# EAGLE design ATMEGA8535 (EAGLE 7.2.0)
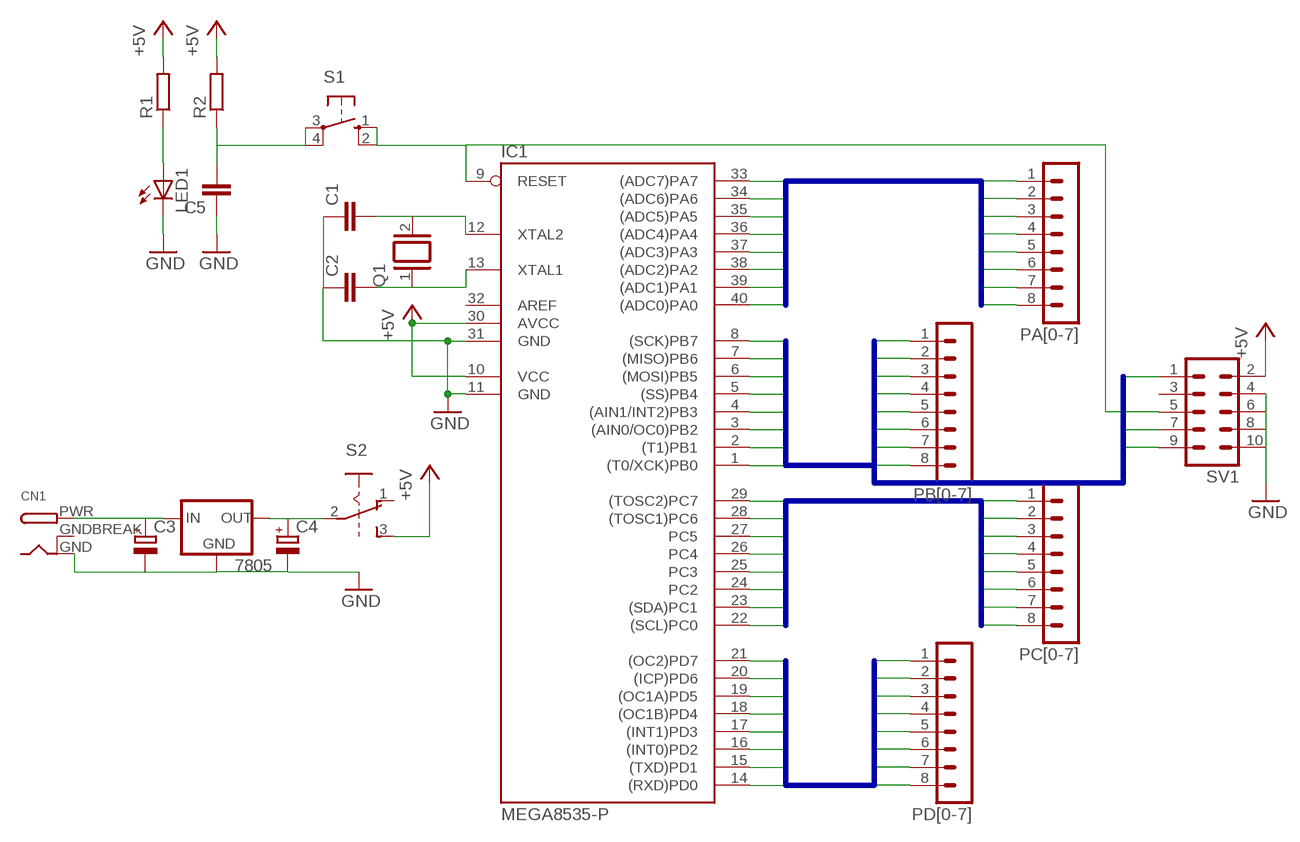
[diagram p0: schematic, sheet 1]

## Parts
7805  78XXL  [78XXL]
C1  C-EU025-025X050  [C025-025X050]
C2  C-EU025-025X050  [C025-025X050]
C3  CPOL-EUE2.5-5  [E2,5-5]
C4  CPOL-EUE2.5-5  [E2,5-5]
C5  C-EU050-025X075  [C050-025X075]
CN1  DCBARRELPTH  [DCJACK_2MM_PTH]
IC1  MEGA8535-P  [DIL40]
LED1  LED5MM  [LED5MM]
PA[0-7]  MA08-1  [MA08-1]
PB[0-7]  MA08-1  [MA08-1]
PC[0-7]  MA08-1  [MA08-1]
PD[0-7]  MA08-1  [MA08-1]
Q1  XTAL/S  [QS]
R1  R-EU_0207/7  [0207/7]
R2  R-EU_0207/7  [0207/7]
S1  10-XX  [B3F-10XX]
S2  A68-A31  [A68-A31]
SV1  MA05-2  [MA05-2]

## Nets
+5V: IC1.10(VCC) IC1.30(AVCC) R1.2 R2.2 S2.3(A:S) SV1.2
GND: 7805.GND C1.1 C2.1 C3.- C4.- C5.1 CN1.GND IC1.11(GND) IC1.31(GND) LED1.K(C) SV1.4 SV1.6 SV1.8 SV1.10
N$3: IC1.9(RESET) S1.1(S) S1.2(S1) SV1.5
N$4: C2.2 IC1.13(XTAL1) Q1.1
N$5: C1.2 IC1.12(XTAL2) Q1.2
N$6: 7805.IN C3.+ CN1.PWR
N$7: LED1.A R1.1
N$8: 7805.OUT C4.+ S2.2(A:P)
N$11: C5.2 R2.1 S1.3(P) S1.4(P1)
PA0: IC1.40((ADC0)PA0) PA[0-7].1
PA1: IC1.39((ADC1)PA1) PA[0-7].2
PA2: IC1.38((ADC2)PA2) PA[0-7].3
PA3: IC1.37((ADC3)PA3) PA[0-7].4
PA4: IC1.36((ADC4)PA4) PA[0-7].5
PA5: IC1.35((ADC5)PA5) PA[0-7].6
PA6: IC1.34((ADC6)PA6) PA[0-7].7
PA7: IC1.33((ADC7)PA7) PA[0-7].8
PB0: IC1.1((T0/XCK)PB0) PB[0-7].1
PB1: IC1.2((T1)PB1) PB[0-7].2
PB2: IC1.3((AIN0/OC0)PB2) PB[0-7].3
PB3: IC1.4((AIN1/INT2)PB3) PB[0-7].4
PB4: IC1.5((SS)PB4) PB[0-7].5
PB5: IC1.6((MOSI)PB5) PB[0-7].6 SV1.1
PB6: IC1.7((MISO)PB6) PB[0-7].7 SV1.9
PB7: IC1.8((SCK)PB7) PB[0-7].8 SV1.7
PC0: IC1.22((SCL)PC0) PC[0-7].1
PC1: IC1.23((SDA)PC1) PC[0-7].2
PC2: IC1.24(PC2) PC[0-7].3
PC3: IC1.25(PC3) PC[0-7].4
PC4: IC1.26(PC4) PC[0-7].5
PC5: IC1.27(PC5) PC[0-7].6
PC6: IC1.28((TOSC1)PC6) PC[0-7].7
PC7: IC1.29((TOSC2)PC7) PC[0-7].8
PD0: IC1.14((RXD)PD0) PD[0-7].1
PD1: IC1.15((TXD)PD1) PD[0-7].2
PD2: IC1.16((INT0)PD2) PD[0-7].3
PD3: IC1.17((INT1)PD3) PD[0-7].4
PD4: IC1.18((OC1B)PD4) PD[0-7].5
PD5: IC1.19((OC1A)PD5) PD[0-7].6
PD6: IC1.20((ICP)PD6) PD[0-7].7
PD7: IC1.21((OC2)PD7) PD[0-7].8
Unconnected: IC1.32(AREF) S2.1(A:O) S2.4(B:O) S2.5(B:P) S2.6(B:S) SV1.3

## Buses
PA[0..7]
PB[0..7]
PC[0..7]
PD[0..7]

## Power pins joined to a net without a drawn wire
GNDBREAK: CN1.GNDBREAK

## Library data of the parts
7805 = v-reg:78XXL: VOLTAGE REGULATOR
C1 C2 C5 = resistor:C-EU: CAPACITOR, European symbol
C3 C4 = resistor:CPOL-EU: POLARIZED CAPACITOR, European symbol
CN1 = adafruit:DCBARREL: 2.0mm DC Barrel Jack DCJACK_2MM_PTH - Through Hole Jack (4UConnector: 05537)
IC1 = atmel:MEGA8535-P: MICROCONTROLLER 8 Kbytes FLASH 512 bytes SRAM 512 bytes EEPROM USART 8-channel 10 bit ADC Source: avr.lbr; MPN: ATMEGA8535-16PU; OC_FARNELL: 9171444; OC_NEWARK: 01M6909
LED1 = adafruit:LED: LED OSRAM: - CHIPLED LG R971, LG N971, LY N971, LG Q971, LY Q971, LO R971, LY R971 LH N974, LH R974 LS Q976, LO Q976, LY Q976 LO Q996 - Hyper CHIPLED LW Q18S LB Q993, LB Q99A, LB R99A - SideLED LS A670, LO A670, LY A670, LG A670, LP A670 LB A673, LV A673, LT A673, LW A673 LH A674 LY A675 LS A676, LA A676, LO A676, LY A676, LW A676 LS A679, LY A679, LG A679 - Hyper Micro SIDELED® LS Y876, LA Y876, LO Y876, LY Y876 LT Y87S - SmartLED LW L88C, LW L88S LB L89C, LB L89S, LG L890 LS L89K, LO L89K, LY L89K LS L896, LA L896, LO L896, LY L896 - TOPLED LS T670, LO T670, LY T670, LG T670, LP T670 LSG T670, LSP T670, LSY T670, LOP T670, LYG T670 LG T671, LOG T671, LSG T671 LB T673, LV T673, LT T673, LW T673 LH T674 LS T676, LA T676, LO T676, LY T676, LB T676, LH T676, LSB T676, LW T676 LB T67C, LV T67C, LT T67C, LS T67K, LO T67K, LY T67K, LW E67C LS E67B, LA E67B, LO E67B, LY E67B, LB E67C, LV E67C, LT E67C LW T67C LS T679, LY T679, LG T679 LS T770, LO T770, LY T770, LG T770, LP T770 LB T773, LV T773, LT T773, LW T773 LH T774 LS E675, LA E675, LY E675, LS T675 LS T776, LA T776, LO T776, LY T776, LB T776 LHGB T686 LT T68C, LB T68C - Hyper Mini TOPLED® LB M676 - Mini TOPLED Santana® LG M470 LS M47K, LO M47K, LY M47K Source: http://www.osram.convergy.de/
PA[0-7] PB[0-7] PC[0-7] PD[0-7] = con-lstb:MA08-1: PIN HEADER; OC_FARNELL: unknown; OC_NEWARK: unknown
Q1 = special:XTAL/S: CRYSTAL
R1 R2 = resistor:R-EU_: RESISTOR, European symbol
S1 = switch-omron:10-XX: OMRON SWITCH; MPN: B3F-1000; OC_FARNELL: 176432; OC_NEWARK: 36M3542
S2 = switch:A68-A31: SLIDING SWITCH Siemens, distributor Buerklin, 11G766
SV1 = con-lstb:MA05-2: PIN HEADER; OC_FARNELL: unknown; OC_NEWARK: unknown

## Net classes
0 default: width 0.508 mm, clearance 0.254 mm
1 vcc: width 0.508 mm, clearance 0.254 mm
2 gnd: width 0.508 mm, clearance 0.254 mm

## Board
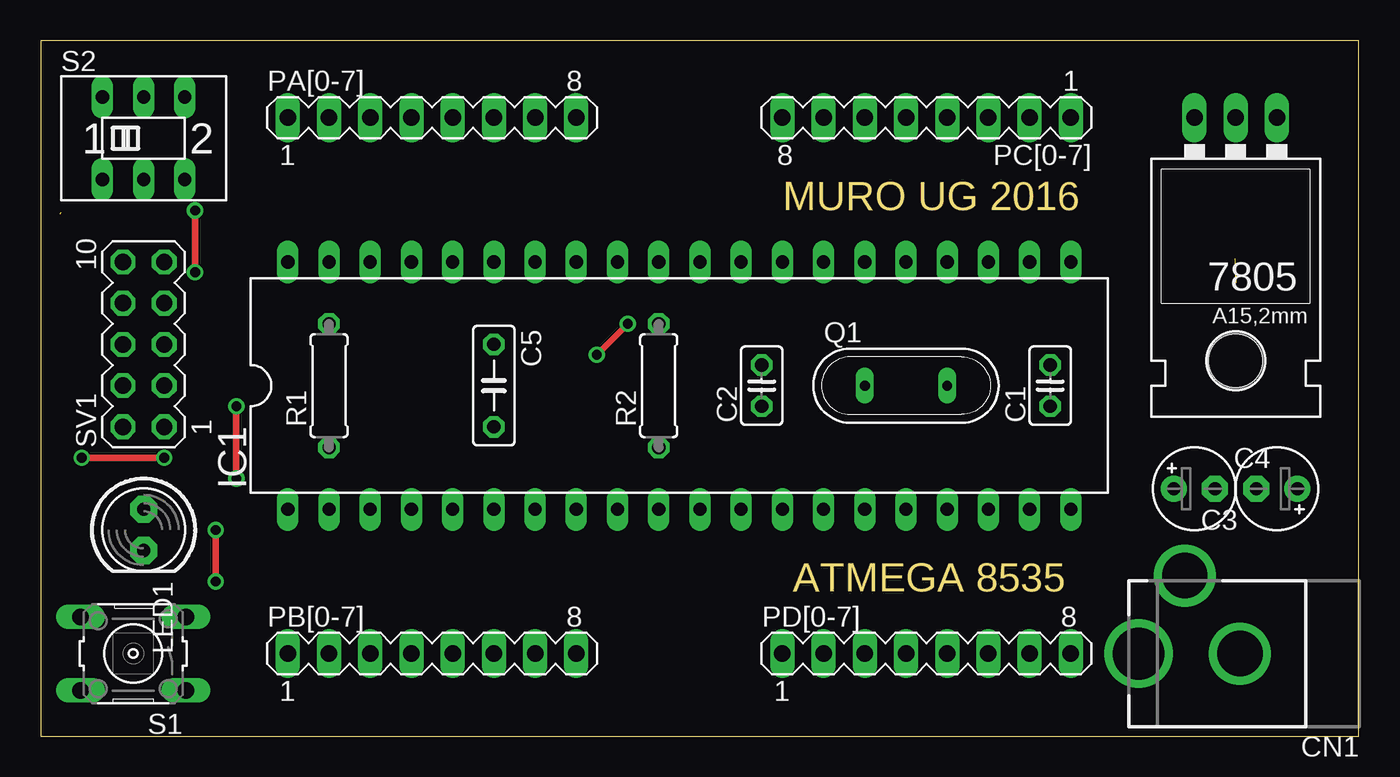
[diagram p1: board, top side]
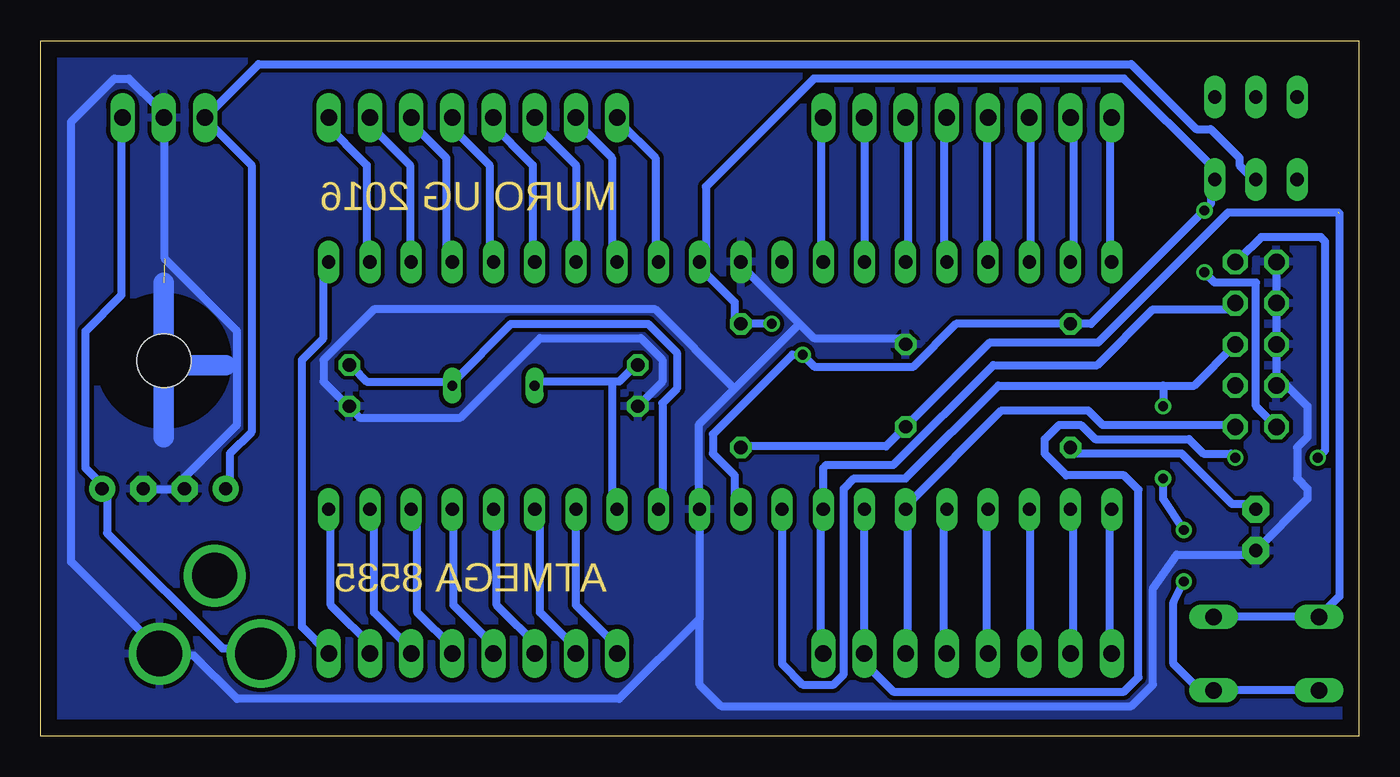
[diagram p2: board, bottom side, seen from below]

Size 81.26 x 42.85 mm. Coordinates in mm from the lower left corner, seen from the top.
Outline: 0,0 81.26,0 81.26,42.85 0,42.85 0,0
Copper layers (1*16): Top 0.035mm / dielectric 1.5mm / Bottom 0.035mm
Design rules "default": minimum track width 10mil, minimum drill 24mil, track to track 8mil, track to pad 8mil, pad to pad 8mil, via to via 8mil, smd to smd 8mil, copper to edge 40mil, drill to drill 8mil, minimum pad ring 10mil, minimum via ring 8mil, stop-mask expansion 4mil, vias tented up to drill 0mil, thermal gap 10mil

### Footprints (pad centres in the part's own frame; a part is rotated, then mirrored left to right if it is on the bottom)
78XXL = drill 1.016 long: GND 0,-3.81; IN -2.54,-3.81; OUT 2.54,-3.81 | hole 3.302: 0,11.176
C025-025X050 = drill 0.813 octagon: 1 -1.27,0; 2 1.27,0
E2,5-5 = drill 0.813 pad 1.6: + -1.27,0 | drill 0.813 pad 1.6 octagon: - 1.27,0
C050-025X075 = drill 0.813 octagon: 1 -2.54,0; 2 2.54,0
DCJACK_2MM_PTH = drill 2.8: GND 0,7.35; GNDBREAK 4.8,10.75 | drill 3.2: PWR 0,13.6
DIL40 = drill 0.813 long: 1 -24.13,-7.62; 2 -21.59,-7.62; 3 -19.05,-7.62; 4 -16.51,-7.62; 5 -13.97,-7.62; 6 -11.43,-7.62; 7 -8.89,-7.62; 8 -6.35,-7.62; 9 -3.81,-7.62; 10 -1.27,-7.62; 11 1.27,-7.62; 12 3.81,-7.62; 13 6.35,-7.62; 14 8.89,-7.62; 15 11.43,-7.62; 16 13.97,-7.62; 17 16.51,-7.62; 18 19.05,-7.62; 19 21.59,-7.62; 20 24.13,-7.62; 21 24.13,7.62; 22 21.59,7.62; 23 19.05,7.62; 24 16.51,7.62; 25 13.97,7.62; 26 11.43,7.62; 27 8.89,7.62; 28 6.35,7.62; 29 3.81,7.62; 30 1.27,7.62; 31 -1.27,7.62; 32 -3.81,7.62; 33 -6.35,7.62; 34 -8.89,7.62; 35 -11.43,7.62; 36 -13.97,7.62; 37 -16.51,7.62; 38 -19.05,7.62; 39 -21.59,7.62; 40 -24.13,7.62
LED5MM = drill 0.813 pad 1.676 octagon: A -1.27,0; K 1.27,0
MA08-1 = drill 1.016 long: 1 -8.89,0; 2 -6.35,0; 3 -3.81,0; 4 -1.27,0; 5 1.27,0; 6 3.81,0; 7 6.35,0; 8 8.89,0
QS = drill 0.61 long: 1 -2.54,0; 2 2.54,0
0207/7 = drill 0.813 octagon: 1 -3.81,0; 2 3.81,0
B3F-10XX = drill 1.016 long: 1 -3.251,2.261; 2 3.251,2.261; 3 -3.251,-2.261; 4 3.251,-2.261
A68-A31 = drill 0.813 long: 1 -2.54,-2.54; 2 0,-2.54; 3 2.54,-2.54; 4 -2.54,2.54; 5 0,2.54; 6 2.54,2.54
MA05-2 = drill 1.016 octagon: 1 -5.08,-1.27; 2 -5.08,1.27; 3 -2.54,-1.27; 4 -2.54,1.27; 5 0,-1.27; 6 0,1.27; 7 2.54,-1.27; 8 2.54,1.27; 9 5.08,-1.27; 10 5.08,1.27

### Placement (x,y rotation side)
7805  73.66,34.29 180 top
C1  62.23,21.59 90 top
C2  44.45,21.59 90 top
C3  76.2,15.24 180 top
C4  71.12,15.24 0 top
C5  27.94,21.59 270 top
CN1  81.28,5.08 90 top
IC1  39.37,21.59 0 top
LED1  6.35,12.7 270 top
PA[0-7]  24.13,38.1 0 top
PB[0-7]  24.13,5.08 0 top
PC[0-7]  54.61,38.1 180 top
PD[0-7]  54.61,5.08 0 top
Q1  53.34,21.59 0 top
R1  17.78,21.59 90 top
R2  38.1,21.59 90 top
S1  5.71,5.08 180 top
S2  6.35,36.83 0 top
SV1  6.35,24.13 90 top

### Tracks (layer width: path | path; a pad name or v marks a point on that pad's centre or on a via)
+5V  (via drill 0.6)
  Top 0.406: v9.52,28.57 v9.52,32.39 | v36.19,25.4 v34.29,23.5
  Bottom 0.508: IC1.10 38.48,14.29 38.48,16.07 39.81,17.4 39.81,18.61 34.92,23.5 v34.29,23.5 | 9.14,34.29 9.14,35.18 14.48,40.51 33.59,40.51 40.26,33.84 40.26,29.4 IC1.30 40.7,28.96 38.48,26.73 38.48,25.4 R2.2 v36.19,25.4 | 9.14,34.29 S2.3 | SV1.2 6.35,20.32 6.35,27.94 8.89,27.94 v9.52,28.57 | 9.14,34.29 9.14,32.77 v9.52,32.39 16.51,25.4 R1.2 24.83,25.4 27.5,22.73 33.53,22.73 v34.29,23.5 | v34.29,23.5 34.61,23.5
GND  (1 unrouted)
  Bottom 0.508: C3.- 74.93,15.18 72.71,15.18 C4.- 72.71,15.62 69.15,19.18 69.15,24.96 73.6,29.4 73.6,37.85 7805.GND 74.04,38.29 74.04,38.73 75.82,40.51 76.71,40.51 79.38,37.85 79.38,10.73 74.04,5.4 CN1.GND 73.6,4.95 71.82,4.95 69.15,2.29 45.59,2.29 40.64,7.24 | C2.1 42.93,21.84 42.93,23.18 44.26,24.51 50.48,24.51 55.37,19.62 61.59,19.62 62.04,20.07 C1.1 62.48,20.51 63.82,21.84 63.82,23.18 60.71,26.29 43.37,26.29 38.48,21.4 | 34.48,25.4 38.04,28.96 IC1.31 | 34.48,25.4 33.59,24.51 28.26,24.51 C5.1 | 34.48,25.4 38.48,21.4 | 38.48,21.4 40.7,19.18 40.7,14.29 IC1.11 40.64,7.24 | 40.64,7.24 40.64,3.17 39.31,1.84 14.03,1.84 12.7,3.17 12.7,9.08 11.24,11.18 6.48,11.18 LED1.K 3.17,14.61 3.17,15.24 3.81,15.87 3.81,17.78 3.17,18.41 3.17,20.32 4.45,21.59 SV1.4 SV1.6 SV1.8 SV1.10
  Bottom 1.27: 73.66,27.94 73.66,22.86 | 73.66,18.41 73.66,22.86 | 73.66,22.86 69.85,22.86
  pour Bottom: 0,43.18 0,0 81.28,0 81.28,43.18
N$3  (via drill 0.6)
  Top 0.406: v12.06,20.32 v12.06,15.87 | v10.8,12.7 v10.8,9.53
  Bottom 0.508: IC1.9 35.56,4.44 34.29,3.17 32.39,3.17 31.75,3.81 31.75,15.24 31.11,15.87 27.94,15.87 22.23,21.59 12.06,21.59 | 12.06,21.59 10.16,21.59 SV1.5 | 12.06,21.59 v12.06,20.32 | S1.2 S1.1 9.8,2.82 11.43,4.44 11.43,8.25 v10.8,9.53 | v10.8,12.7 12.06,14.61 v12.06,15.87
N$4
  Bottom 0.508: 46.04,21.84 45.59,21.84 44.7,22.73 C2.2 | 46.04,21.84 50.48,21.84 Q1.1 | 46.04,21.84 46.04,14.29 IC1.13
N$5
  Bottom 0.508: C1.2 62.04,22.73 61.15,21.84 56.26,21.84 Q1.2 55.82,21.84 52.26,25.4 43.81,25.4 42.04,23.62 42.04,21.4 42.93,20.51 42.93,14.29 IC1.12
N$6
  Bottom 0.508: 7805.IN 76.26,37.85 76.26,27.18 78.49,24.96 78.49,16.51 77.6,15.62 C3.+ 77.15,15.18 77.15,12.51 70.04,5.4 67.82,5.4 CN1.PWR
N$7
  Bottom 0.508: R1.1 17.59,17.4 10.92,17.4 7.81,14.29 6.48,14.29 LED1.A
N$8
  Bottom 0.508: S2.2 6.48,34.29 7.37,35.18 7.37,35.62 9.14,37.4 10.03,37.4 14.03,41.4 67.82,41.4 7805.OUT 70.93,37.85 68.26,35.18 68.26,18.73 69.6,17.4 69.6,15.62 C4.+
N$11  (1 unrouted)
  Bottom 0.508: R2.1 38.04,17.84 29.15,17.84 C5.2 22.73,24.26 16.07,24.26 8.06,32.26 1.27,32.26 | 1.21,32.19 1.21,8.6 S1.4 S1.3
PA0
  Bottom 0.508: IC1.40 15.37,29.4 15.37,37.85 PA[0-7].1
PA1
  Bottom 0.508: IC1.39 17.59,29.4 17.59,37.85 PA[0-7].2
PA2
  Bottom 0.508: IC1.38 20.26,29.4 20.26,37.85 PA[0-7].3
PA3
  Bottom 0.508: IC1.37 22.92,29.4 22.92,37.85 PA[0-7].4
PA4
  Bottom 0.508: IC1.36 25.59,29.4 25.59,37.85 PA[0-7].5
PA5
  Bottom 0.508: IC1.35 27.81,29.4 27.81,37.85 PA[0-7].6
PA6
  Bottom 0.508: PA[0-7].7 IC1.34
PA7
  Bottom 0.508: IC1.33 33.15,29.4 33.15,37.85 PA[0-7].8
PB0
  Bottom 0.508: IC1.1 15.37,13.84 15.37,5.4 PB[0-7].1
PB1
  Bottom 0.508: IC1.2 17.59,13.84 17.59,5.4 PB[0-7].2
PB2
  Bottom 0.508: IC1.3 20.26,13.84 20.26,5.4 PB[0-7].3
PB3
  Bottom 0.508: IC1.4 22.92,13.84 22.92,5.4 PB[0-7].4
PB4
  Bottom 0.508: IC1.5 25.59,13.84 25.59,5.4 PB[0-7].5
PB5
  Bottom 0.508: PB[0-7].6 27.81,5.4 27.81,13.84 IC1.6 27.81,14.29 22.03,20.07 16.7,20.07 15.81,19.18 7.81,19.18 SV1.1
PB6  (via drill 0.6)
  Top 0.406: v2.54,17.14 v7.62,17.14
  Bottom 0.508: IC1.7 PB[0-7].7 30.48,4.51 28.7,2.73 14.48,2.73 13.59,3.62 13.59,15.18 14.48,16.07 18.03,16.07 19.37,17.4 19.37,18.29 18.48,19.18 17.14,19.18 16.26,18.29 10.48,18.29 9.59,17.4 7.87,17.4 v7.62,17.14 | SV1.9 7.37,29.4 6.03,30.73 2.35,30.73 2.1,30.48 2.1,17.59 v2.54,17.14
PB7
  Bottom 0.508: PB[0-7].8 33.15,5.4 33.15,13.84 IC1.8 33.02,16.51 32.83,16.7 28.7,16.7 22.54,22.86 16.13,22.86 12.7,26.29 7.81,26.29 SV1.7
PC0
  Bottom 0.508: IC1.22 61.15,29.4 61.15,35.18 63.82,37.85 PC[0-7].1
PC1
  Bottom 0.508: IC1.23 58.48,29.4 58.48,35.18 61.15,37.85 PC[0-7].2
PC2
  Bottom 0.508: IC1.24 56.26,29.4 56.26,35.62 58.48,37.85 PC[0-7].3
PC3
  Bottom 0.508: IC1.25 53.59,29.4 53.59,35.18 56.26,37.85 PC[0-7].4
PC4
  Bottom 0.508: IC1.26 50.93,29.4 50.93,35.18 53.59,37.85 PC[0-7].5
PC5
  Bottom 0.508: IC1.27 48.26,35.18 50.93,37.85 PC[0-7].6
PC6
  Bottom 0.508: IC1.28 46.04,29.4 46.04,35.62 48.26,37.85 PC[0-7].7
PC7
  Bottom 0.508: IC1.29 43.37,29.4 43.37,35.62 45.59,37.85 PC[0-7].8
PD0
  Bottom 0.508: IC1.14 48.26,8.07 45.59,5.4 PD[0-7].1
PD1
  Bottom 0.508: IC1.15 50.48,13.84 50.48,7.62 48.26,5.4 PD[0-7].2
PD2
  Bottom 0.508: IC1.16 53.15,13.84 53.15,8.07 50.48,5.4 PD[0-7].3
PD3
  Bottom 0.508: IC1.17 55.82,13.84 55.82,8.07 53.15,5.4 PD[0-7].4
PD4
  Bottom 0.508: IC1.18 58.04,13.84 58.04,7.62 55.82,5.4 PD[0-7].5
PD5
  Bottom 0.508: IC1.19 60.71,13.84 60.71,7.62 58.48,5.4 PD[0-7].6
PD6
  Bottom 0.508: IC1.20 63.37,13.84 63.37,8.07 60.71,5.4 PD[0-7].7
PD7
  Bottom 0.508: PD[0-7].8 65.15,6.73 65.15,23.18 63.82,24.51 63.82,28.96 IC1.21

### Text on the board
Dimension: MURO UG 2016 | ATMEGA 8535